# EasyEDA Pro project zFocus_remote_ferq.eprj

# Schematic Schematic1
Create Date: 2023-02-25; Page Name: P1; Project Name: zFocus_remote_ferq; Schematic Name: Schematic1; Update Date: 2023-02-25; Company: 嘉立创EDA; Page Size: A4; Version: V1.0
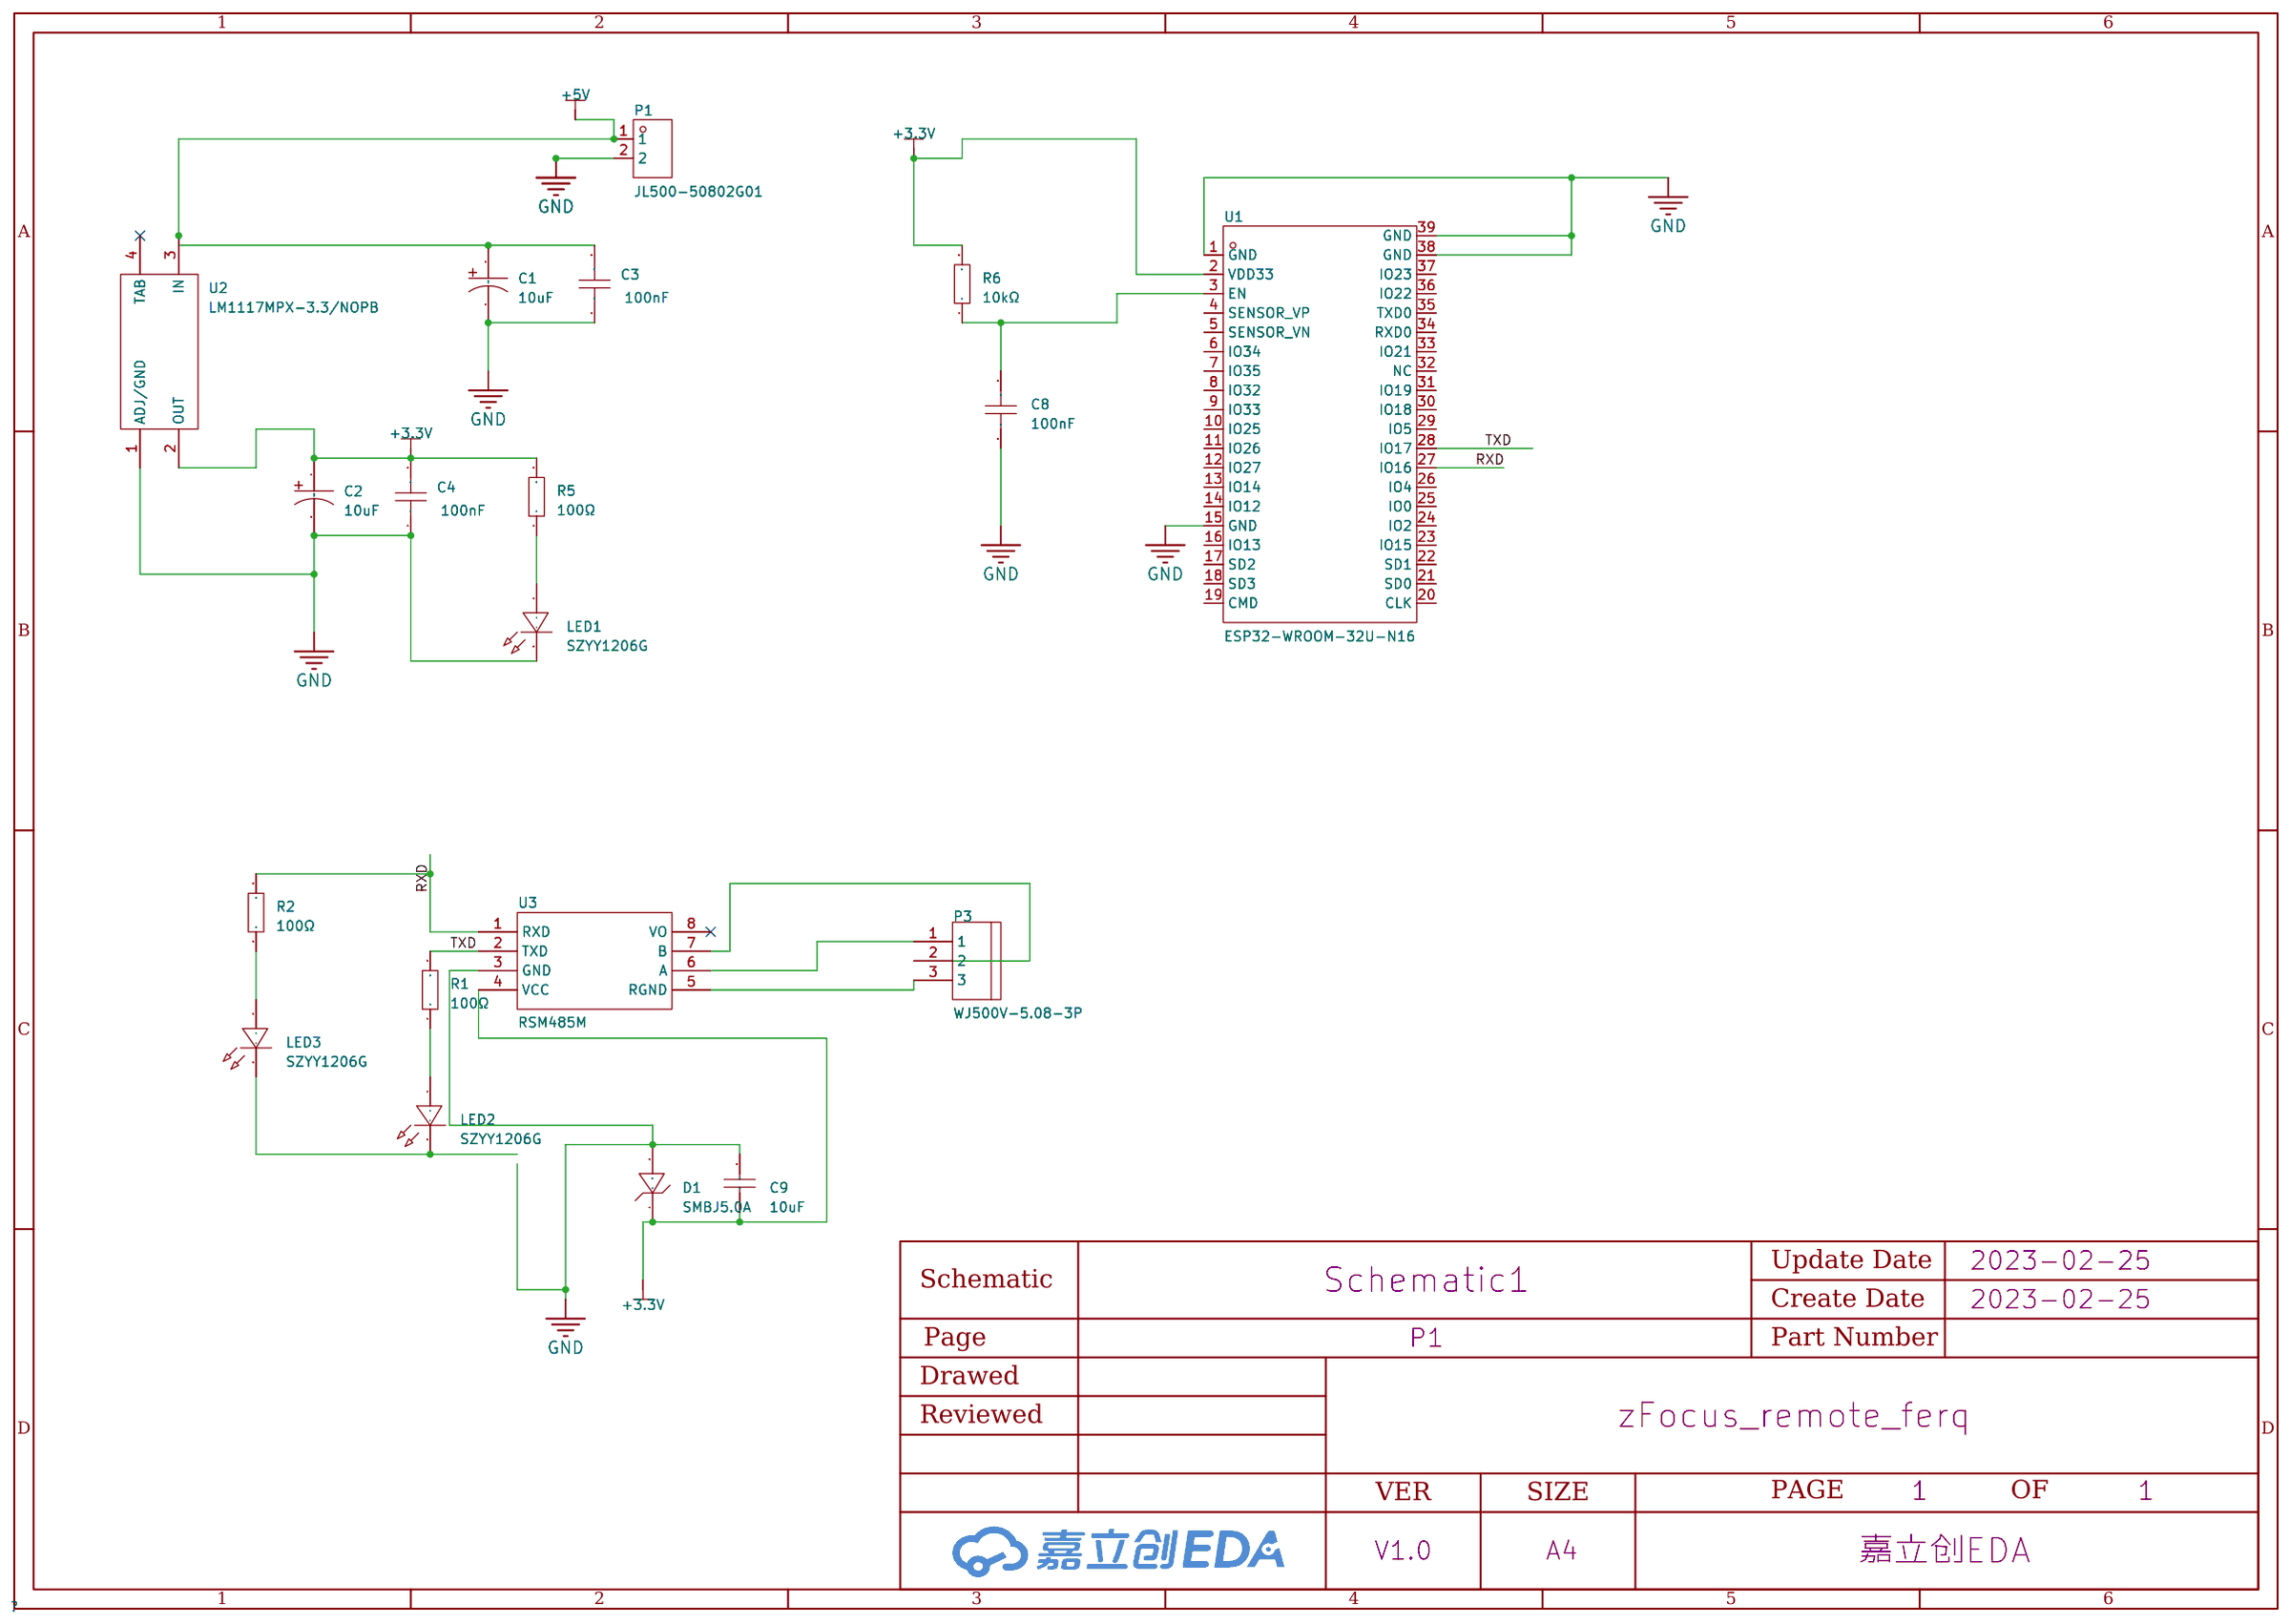
[diagram p0: schematic sheet]

## Parts
C1  10uF  [CAP-SMD_BD4.0-L4.3-W4.3-LS5.0-FD]
C2  10uF  [CAP-SMD_BD4.0-L4.3-W4.3-LS5.0-FD]
C3  100nF  [C1206]
C4  100nF  [C1206]
C8  100nF  [C1206]
C9  10uF  [C1206]
D1  SMBJ5.0A  [SMB_L4.6-W3.6-LS5.3-RD]
LED1  SZYY1206G  [LED1206-R-RD]
LED2  SZYY1206G  [LED1206-R-RD]
LED3  SZYY1206G  [LED1206-R-RD]
P1  JL500-50802G01  [CONN-TH_2P-P5.08_JL500-50002G01]
P3  WJ500V-5.08-3P  [CONN-TH_3P-P5.00_WJ500V-5.08-3P]
R1  100Ω  [R1206]
R2  100Ω  [R1206]
R5  100Ω  [R1206]
R6  10kΩ  [R1206]
U1  ESP32-WROOM-32U-N16  [WIFIM-SMD_39P-L19.2-W18.0-P1.27]
U2  LM1117MPX-3.3/NOPB  [SOT-223-3_L6.5-W3.4-P2.30-LS7.0-BR]
U3  RSM485M  [COMM-TH_RSM485M]

## Library data of the parts
C1 C2 = RVT1V100M0405: 容值:10uF;精度:±20%;额定电压:35V;电容体直径:4mm;电容体长度:5.4mm;纹波电流:-;等效串联电阻:-;工作寿命:2000hrs@105℃;工作温度:-55℃~+105℃;; LCSC Part Name: 10uF ±20% 35V; Supplier Part: C86602; Manufacturer: HONOR(荣誉); Supplier Footprint: SMD,D4xL5.4mm; JLCPCB Part Class: Extended Part; Datasheet: https://atta.szlcsc.com/upload/public/pdf/source/20210521/C113284_25C86AE95FB541053FE695F13EA8E7D0.pdf; Supplier: LCSC; Tolerance: ±20%; Rated Voltage: 35V; φD: 4mm; L: 5.4mm; Lifetime @ Temp: 2000hrs@105℃; Operating Temperature: -55℃~+105℃
C3 C4 = TCC1206X7R104M500DT: 温度系数:X7R;容值:100nF;精度:±20%;额定电压:50V;; LCSC Part Name: 100nF(104) ±20% 50V; Supplier Part: C377067; Manufacturer: CCTC(三环); Supplier Footprint: 1206; JLCPCB Part Class: Extended Part; Datasheet: https://atta.szlcsc.com/upload/public/pdf/source/20190327/C377067_340E4DDDA8A40C1E413FF83585EE122C.pdf; Supplier: LCSC; Temperature Coefficient: X7R; Tolerance: ±20%; Voltage Rated: 50V
C8 = CC1206KRX7R9BB104: 容值:100nF;精度:±10%;额定电压:50V;材质(温度系数):X7R;; LCSC Part Name: 100nF ±10% 50V; Supplier Part: C82601; Manufacturer: YAGEO(国巨); Supplier Footprint: 1206; JLCPCB Part Class: Extended Part; Datasheet: https://atta.szlcsc.com/upload/public/pdf/source/20161024/1477288461832.pdf; Supplier: LCSC; Tolerance: ±10%; Voltage Rated: 50V; Temperature Coefficient: X7R
C9 = CL31A106KAHNNNE: 容值:10uF;精度:±10%;额定电压:25V;材质(温度系数):X5R;; LCSC Part Name: 10uF ±10% 25V; Supplier Part: C9807; Manufacturer: SAMSUNG(三星); Supplier Footprint: 1206; JLCPCB Part Class: Extended Part; Datasheet: https://atta.szlcsc.com/upload/public/pdf/source/20160103/1457707744674.pdf; Supplier: LCSC; Tolerance: ±10%; Voltage Rated: 25V; Temperature Coefficient: X5R
D1 = SMBJ5.0A_C83333: 极性:单向;反向截止电压(Vrwm):5V;击穿电压:6.4V;峰值脉冲电流(Ipp)@10/1000s:-;最大钳位电压:9.2V;峰值脉冲功率(Ppp)@10/1000s:600W;; LCSC Part Name: 单向 Vrwm:5V 600W; Supplier Part: C83333; Manufacturer: Littelfuse(美国力特); Supplier Footprint: SMB(DO-214AA); JLCPCB Part Class: Extended Part; Datasheet: https://atta.szlcsc.com/upload/public/pdf/source/20180622/C83333_54A96CB13F34736FC2597463A926577F.pdf; Supplier: LCSC; Polarity: 单向; Reverse Stand-Off Voltage (Vrwm): 5V; Breakdown Voltage: 6.4V; Maximum Clamping Voltage: 9.2V; Peak Pulse Power Dissipation (Ppp)@10/1000μs: 600W
LED1-LED3 = SZYY1206G: 发光颜色:翠绿;; LCSC Part Name: 翠绿; Supplier Part: C434439; Manufacturer: yongyu(永裕光电); Supplier Footprint: 1206; JLCPCB Part Class: Extended Part; Datasheet: https://atta.szlcsc.com/upload/public/pdf/source/20200628/C434439_0A6287F1EA2604FB8C8003896F01CB92.pdf; Supplier: LCSC; Emitted Color: 翠绿
P1 = JL500-50802G01_C709041: 间距:5.08mm;排数:1;每排PIN数:2;额定电流:15A;额定电压:300V;线规 - AWG:26~14;线规 - mm?:0.2~2;触头材质:铜;触头镀层:锡;工作温度范围:-40℃~+105℃;焊接温度(最大值):250℃;颜色:绿色;; LCSC Part Name: 5.08mm 排数:1 每排P数:2; Supplier Part: C709041; Manufacturer: JILN(锦凌); Supplier Footprint: P=5.08mm; JLCPCB Part Class: Extended Part; Supplier: LCSC; Pitch: 5.08mm; Number of Rows: 1; Number of PINs Per Row: 2; Current Rating (Max): 15A; Voltage Rating (Max): 300V; Wire Gauge - AWG: 26~14; Wire Gauge - mm?: 0.2~2; Contact Material: 铜; Contact Plating: 锡; Operating Temperature Range: -40℃~+105℃; Welding Temperature (Max): 250℃; Color: 绿色
P3 = WJ500V-5.08-3P: 间距:5.08mm;排数:1;每排PIN数:3;安装方式:直针;额定电流:18A;额定电压:250V;线规 - AWG:14~30;线规 - mm2:2.5;工作温度范围:-40℃~+105℃;颜色:绿色;; LCSC Part Name: 5.08mm 排数:1 每排P数:3 直针 可拼接; Supplier Part: C72334; Manufacturer: KANGNEX(康奈克斯电气); Supplier Footprint: 插件,P=5.08mm; JLCPCB Part Class: Extended Part; Datasheet: https://atta.szlcsc.com/upload/public/pdf/source/20191225/C72334_8A5EF831D67650233B6B1E3F2BC06274.pdf; Supplier: LCSC; Pitch: 5.08mm; Number of Rows: 1; Number of PINs Per Row: 3; Mounting Style: 直针; Current Rating (Max): 18A; Voltage Rating (Max): 250V; Wire Gauge - AWG: 14~30; Wire Gauge - mm2: 2.5; Operating Temperature Range: -40℃~+105℃; Color: 绿色
R1 R2 R5 = 1206W4F1000T5E: 电阻类型:厚膜电阻;阻值:100Ω;精度:±1%;功率:250mW;温度系数:±100ppm/℃;最大工作电压:200V;工作温度范围:-55℃~+155℃;; LCSC Part Name: 100Ω ±1% 250mW; Supplier Part: C17901; Manufacturer: UNI-ROYAL(厚声); Supplier Footprint: 1206; JLCPCB Part Class: Basic Part; Datasheet: https://atta.szlcsc.com/upload/public/pdf/source/20200306/C422600_1E6D84923E4A46A82E41ADD87F860B5C.pdf; Supplier: LCSC; Type: 厚膜电阻; Tolerance: ±1%; Power(Watts): 250mW; Temperature Coefficient: ±100ppm/℃; Overload Voltage (Max): 200V; Operating Temperature Range: -55℃~+155℃
R6 = 1206W4F1002T5E: 电阻类型:厚膜电阻;阻值:10kΩ;精度:±1%;功率:250mW;温度系数:±100ppm/℃;最大工作电压:200V;工作温度范围:-55℃~+155℃;; LCSC Part Name: 10kΩ ±1% 250mW; Supplier Part: C17902; Manufacturer: UNI-ROYAL(厚声); Supplier Footprint: 1206; JLCPCB Part Class: Basic Part; Datasheet: https://atta.szlcsc.com/upload/public/pdf/source/20200306/C422600_1E6D84923E4A46A82E41ADD87F860B5C.pdf; Supplier: LCSC; Type: 厚膜电阻; Tolerance: ±1%; Power(Watts): 250mW; Temperature Coefficient: ±100ppm/℃; Overload Voltage (Max): 200V; Operating Temperature Range: -55℃~+155℃
U1 = ESP32-WROOM-32U-N16_C529580: Supplier Part: C529580; Manufacturer: ESPRESSIF(乐鑫); JLCPCB Part Class: Extended Part; Datasheet: https://atta.szlcsc.com/upload/public/pdf/source/20200521/C529577_90A62DBC94C4A28650A646C18DE51576.pdf; Supplier: LCSC
U2 = LM1117MPX-3.3/NOPB: 输出类型:固定;输出极性:正;输出通道数:1;最大输入电压:15V;输出电压:3.3V;压差:1.2V@(800mA);输出电流:800mA;电源纹波抑制比(PSRR):75dB@(120Hz);; LCSC Part Name: 正 Vin=15V Vout=3.3V 800mA 75dB@(120Hz); Supplier Part: C9662; Manufacturer: TI(德州仪器); Supplier Footprint: SOT-223; JLCPCB Part Class: Extended Part; Datasheet: https://atta.szlcsc.com/upload/public/pdf/source/20160806/1470478007762.pdf; Supplier: LCSC; Output Type: 固定; Output Polarity: 正; Number of Outputs: 1; Maximum Input Voltage: 15V; Output Voltage: 3.3V; Dropout Voltage: 1.2V@(800mA); Output Current: 800mA; Power Supply Rejection Ratio (PSRR): 75dB@(120Hz)
U3 = RSM485M: 数据速率:500Kbps;节点数:64;静态电流:27mA;电源电压:3.15V~5.25V;静电保护:否;隔离:2500V;自动流控:否;; LCSC Part Name: 500Kbps 64; Supplier Part: C133365; Manufacturer: ZLG(致远电子); Supplier Footprint: DIP-8; JLCPCB Part Class: Extended Part; Datasheet: https://atta.szlcsc.com/upload/public/pdf/source/20171014/C133365_15079755010921038240.pdf; Supplier: LCSC; Data Rate: 500Kbps; Node Number: 64; Quiescent Current: 27mA; Supply Voltage: 3.15V~5.25V; ESD Protect: 否; isolation: 2500V; Automatic flow control: 否; Operating Temperature: -40℃~+105℃

## Nets
+3.3V: C2.1 C4.2 C9.1 D1.1 R5.2 R6.2 U1.2(VDD33) U2.2(OUT) U3.4(VCC)
+5V: C1.1 C3.2 P1.1 U2.3(IN)
GND: C1.2 C2.2 C3.1 C4.1 C8.1 C9.2 D1.2 LED1.2(-) P1.2 U1.1(GND) U1.15(GND) U1.38(GND) U1.39(GND) U2.1(ADJ/GND) U3.3(GND)
RXD: R2.2 U1.27(IO16) U3.1(RXD)
TXD: R1.2 U1.28(IO17) U3.2(TXD)
$1N581: LED1.1(+) R5.1
$1N1533: C8.2 R6.1 U1.3(EN)
$1N3841: P3.3 U3.5(RGND)
$1N3861: P3.1 U3.6(A)
$1N3882: P3.2 U3.7(B)
$1N5862: LED2.1(+) R1.1
$1N5884: LED3.1(+) R2.1
$1N6475: LED2.2(-) LED3.2(-)

Not connected (* = marked no-connect by the designer): U1 4(SENSOR_VP) 5(SENSOR_VN) 6(IO34) 7(IO35) 8(IO32) 9(IO33) 10(IO25) 11(IO26) 12(IO27) 13(IO14) 14(IO12) 16(IO13) 17(SD2) 18(SD3) 19(CMD) 20(CLK) 21(SD0) 22(SD1) 23(IO15) 24(IO2) 25(IO0) 26(IO4) 29(IO5) 30(IO18) 31(IO19) 32(NC) 33(IO21) 34(RXD0) 35(TXD0) 36(IO22) 37(IO23); U2 4(TAB)*; U3 8(VO)*

# Board PCB1
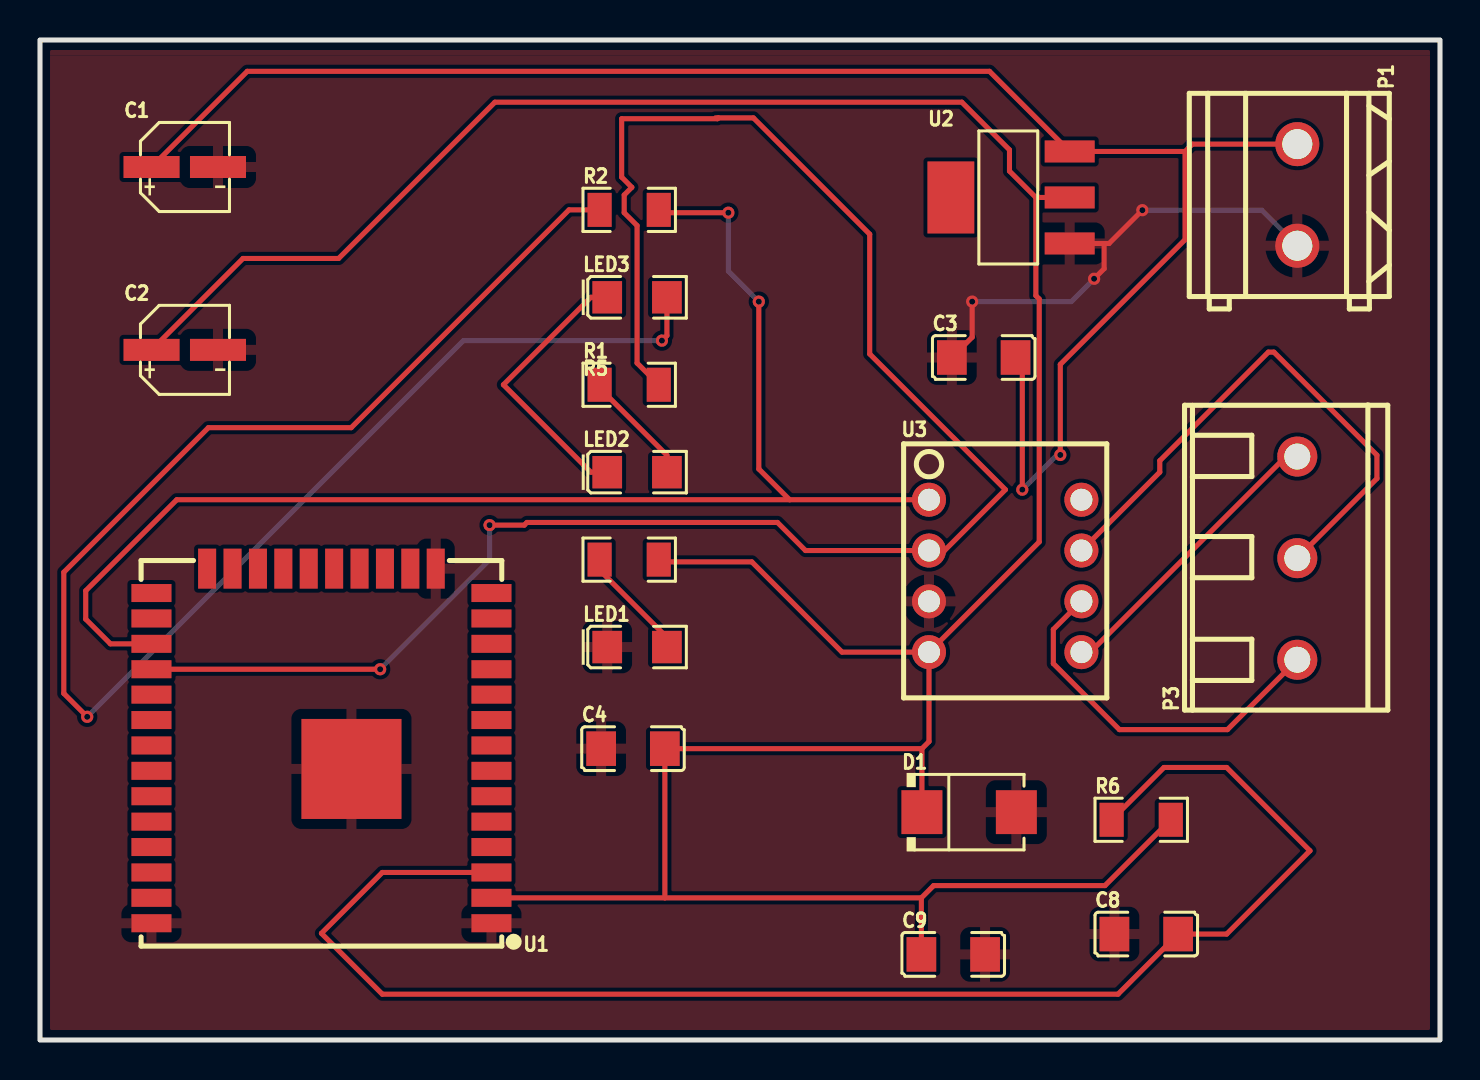
[diagram p1: board, top side]
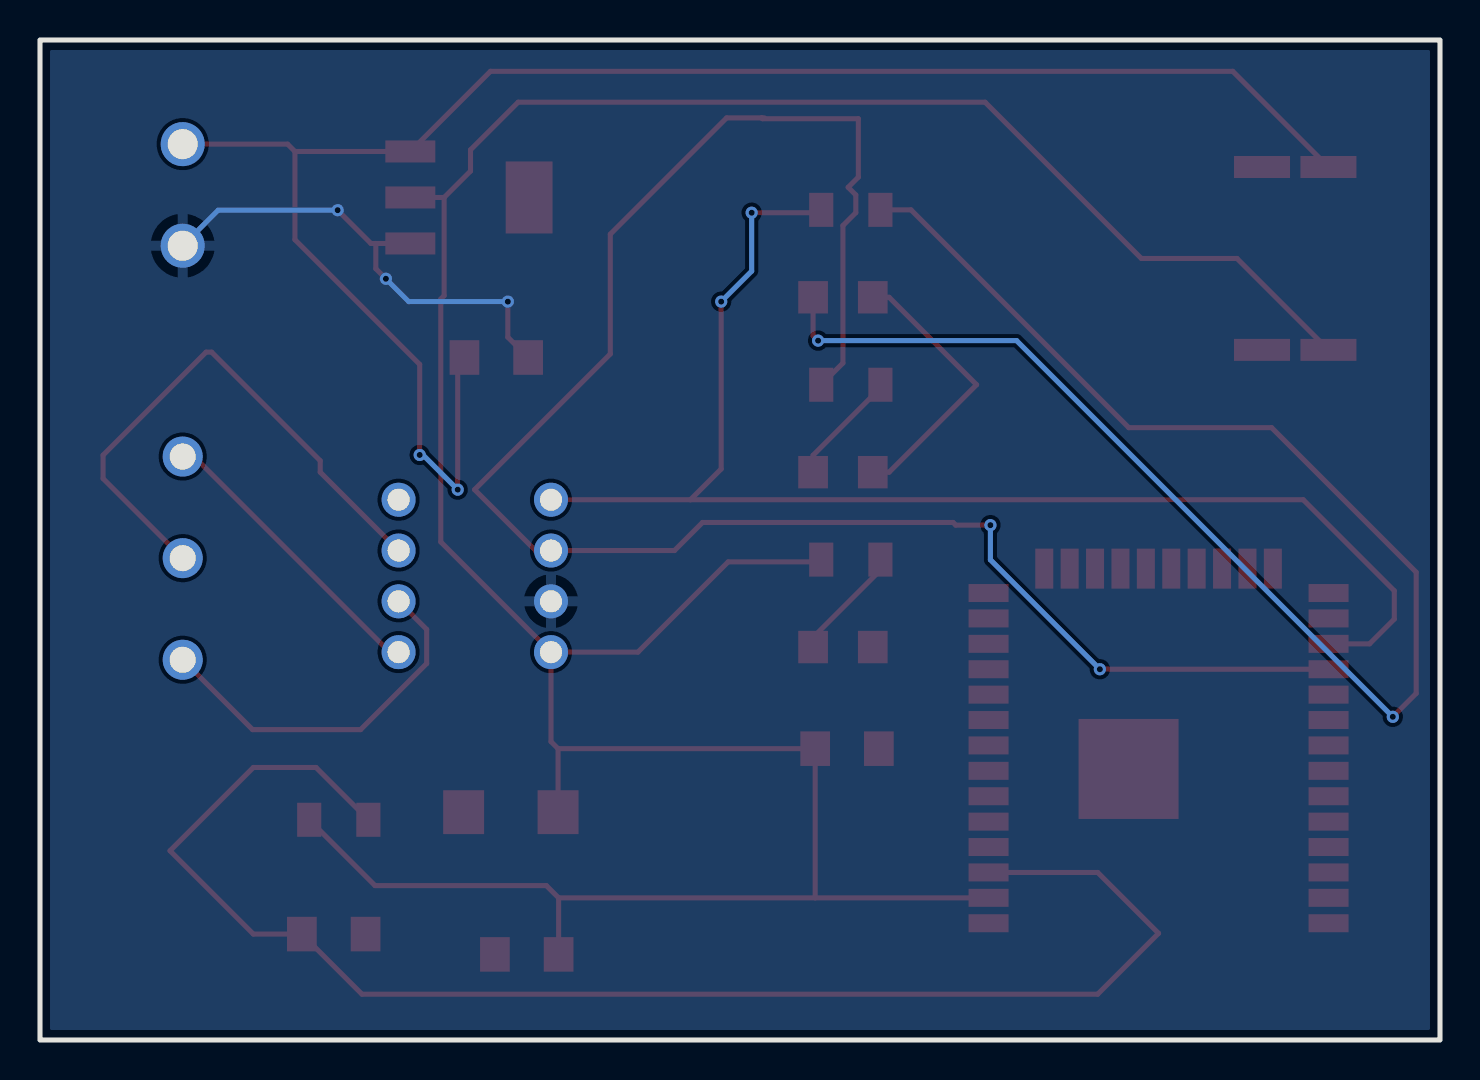
[diagram p2: board, bottom side, seen from below]

Outline 70 x 50 mm; copper layers: Top Layer, Bottom Layer. Coordinates in mm from the lower left corner of the outline.
Outline path: rectangle 0,50 70,0
Stack: Top Layer 0.035mm / Dielectric1 1.51mm FR4 er 4.5 / Bottom Layer 0.035mm

## Design rules (mm)
spacing safeClearance (default): track to track 0.152, other pairs 0.152 to 0.3
track width trackWidth (default): min 0.127, default 0.254, max 2.54
differential pair differentialPair (default): width min 0.127, default 0.254, max 2.54; gap min 0.152, default 0.152
via viaSize (default): diameter min 0.5, default 0.61, max 10; hole min 0.3, default 0.305, max 6

## Placement (name value [footprint] x y rotation side)
C1  10uF  [CAP-SMD_BD4.0-L4.3-W4.3-LS5.0-FD]  7.24 43.65 0 top
C2  10uF  [CAP-SMD_BD4.0-L4.3-W4.3-LS5.0-FD]  7.24 34.51 0 top
C3  100nF  [C1206]  47.19 34.13 0 top
C4  100nF  [C1206]  29.65 14.57 0 top
C8  100nF  [C1206]  55.31 5.3 0 top
C9  10uF  [C1206]  45.66 4.28 0 top
D1  SMBJ5.0A  [SMB_L4.6-W3.6-LS5.3-RD]  46.46 11.39 0 top
LED1  SZYY1206G  [LED1206-R-RD]  29.85 19.65 0 top
LED2  SZYY1206G  [LED1206-R-RD]  29.85 28.39 0 top
LED3  SZYY1206G  [LED1206-R-RD]  29.85 37.14 0 top
P1  JL500-50802G01  [CONN-TH_2P-P5.08_JL500-50002G01]  62.86 42.25 270 top
P3  WJ500V-5.08-3P  [CONN-TH_3P-P5.00_WJ500V-5.08-3P]  62.86 24.09 90 top
R1  100Ω  [R1206]  29.46 32.76 0 top
R2  100Ω  [R1206]  29.46 41.51 0 top
R5  100Ω  [R1206]  29.46 24.02 0 top
R6  10kΩ  [R1206]  55.06 11.01 0 top
U1  ESP32-WROOM-32U-N16  [WIFIM-SMD_39P-L19.2-W18.0-P1.27]  14.07 14.7 180 top
U2  LM1117MPX-3.3/NOPB  [SOT-223-3_L6.5-W3.4-P2.30-LS7.0-BR]  48.51 42.13 0 top
U3  RSM485M  [COMM-TH_RSM485M]  48.26 23.2 0 top

## Footprints (pads in the part's own frame, mm; a bottom-side part is the same pattern mirrored in y, then rotated)
C1206
  rect 1.485x1.728 smd: 1(-1.593,0) 2(1.593,0)
CAP-SMD_BD4.0-L4.3-W4.3-LS5.0-FD
  rect 2.8x1.1 smd: 1(-1.661,0) 2(1.661,0)
COMM-TH_RSM485M
  round 1.7 hole 1.1: 1(-3.81,3.81) 2(-3.81,1.27) 3(-3.81,-1.27) 4(-3.81,-3.81) 5(3.81,-3.81) 6(3.81,-1.27) 7(3.81,1.27) 8(3.81,3.81)
CONN-TH_2P-P5.08_JL500-50002G01
  round 2.2 hole 1.5: 1(-2.54,0) 2(2.54,0)
CONN-TH_3P-P5.00_WJ500V-5.08-3P
  round 2 hole 1.3: 1(-5.08,0) 2(0,0) 3(5.08,0)
LED1206-R-RD
  rect 1.485x1.62 smd: 1(1.492,0) 2(-1.492,0)
R1206
  rect 1.208x1.701 smd: 1(-1.479,0) 2(1.479,0)
SMB_L4.6-W3.6-LS5.3-RD
  rect 2.047x2.192 smd: 1(-2.361,0) 2(2.361,0)
SOT-223-3_L6.5-W3.4-P2.30-LS7.0-BR
  rect 2.5x1.1 smd: 1(2.97,-2.3) 2(2.97,0) 3(2.97,2.3)
  rect 2.34x3.6 smd: 4(-2.97,0)
WIFIM-SMD_39P-L19.2-W18.0-P1.27
  rect 2x0.9 smd: 1(-8.5,8.865) 2(-8.5,7.595) 3(-8.5,6.325) 4(-8.5,5.055) 5(-8.5,3.785) 6(-8.5,2.515) 7(-8.5,1.245) 8(-8.5,-0.025) 9(-8.5,-1.295) 10(-8.5,-2.565) 11(-8.5,-3.835) 12(-8.5,-5.105) 13(-8.5,-6.375) 14(-8.5,-7.645) 25(8.5,-7.645) 26(8.5,-6.375) 27(8.5,-5.105) 28(8.5,-3.835) 29(8.5,-2.565) 30(8.5,-1.295) 31(8.5,-0.025) 32(8.5,1.245) 33(8.5,2.515) 34(8.5,3.785) 35(8.5,5.055) 36(8.5,6.325) 37(8.5,7.595) 38(8.5,8.865)
  rect 0.9x2 smd: 15(-5.715,-8.865) 16(-4.445,-8.865) 17(-3.175,-8.865) 18(-1.905,-8.865) 19(-0.635,-8.865) 20(0.635,-8.865) 21(1.905,-8.865) 22(3.175,-8.865) 23(4.445,-8.865) 24(5.715,-8.865)
  rect 5x5 smd: 39(-1.5,1.15)

## Nets
As in the schematic.

Pads without a net: U1 4 5 6 7 8 9 10 11 12 13 14 16 17 18 19 20 21 22 23 24 25 26 29 30 31 32 33 34 35 36 37; U2 4; U3 8

## Via types
v1: diameter 0.61, hole 0.305, Top Layer to Bottom Layer, 11 vias

## Routing (per net, layer and track width the routed paths; a pad name or vN(x,y) marks a point on that pad's centre or on a via; arc(x,y) is an arc through that point)
+3.3V: length 161
  Top Layer w0.254: U3.4 44.45,14.92 44.1,14.57 ; U3.4 40.1,19.39 35.59,23.91 31.05,23.91 R5.2 ; U3.4 49.96,24.9 49.96,37.05 49.79,37.22 49.79,42.13 ; 31.24,7.11 44.07,7.11 ; 31.24,7.11 C4.2 44.1,14.57 ; 31.24,7.11 U1.2 ; 44.07,7.11 44.68,7.72 53.25,7.72 R6.2 ; 44.07,7.11 C9.1 ; 49.79,42.13 U2.2 ; 49.79,42.13 48.47,43.45 48.47,44.51 46.09,46.89 22.74,46.89 14.93,39.08 10.15,39.08 C2.1 ; 44.1,14.57 D1.1
+5V: length 88.2
  Top Layer w0.254: 57.25,44.43 57.62,44.79 P1.1 ; 57.25,44.43 57.25,40.02 51.02,33.78 v1(51.02,29.25) ; 57.25,44.43 U2.3 47.48,48.43 10.36,48.43 C1.1 ; v1(49.11,27.52) 49.11,33.79 C3.2
  Bottom Layer w0.254: v1(49.11,27.52) 50.85,29.25 v1(51.02,29.25)
GND: length 24.6
  Top Layer w0.254: v1(46.61,36.92) 46.61,35.14 C3.1 ; v1(55.12,41.49) 53.45,39.83 53.21,39.83 ; U2.1 53.21,39.83 ; 53.21,39.83 53.21,38.57 v1(52.7,38.06)
  Bottom Layer w0.254: P1.2 61.09,41.49 v1(55.12,41.49) ; v1(52.7,38.06) 51.56,36.92 v1(46.61,36.92)
RXD: length 68.4
  Top Layer w0.254: U1.27 3.52,19.81 2.29,21.04 2.29,22.46 6.84,27.01 37.48,27.01 ; 37.48,27.01 35.94,28.55 v1(35.94,36.92) ; 37.48,27.01 U3.1 ; v1(34.42,41.36) 31.08,41.36 R2.2
  Bottom Layer w0.254: v1(34.42,41.36) 34.42,38.44 v1(35.94,36.92)
TXD: length 93.5
  Top Layer w0.254: R1.2 29.85,33.85 29.85,40.72 29.21,41.36 29.21,42.25 29.59,42.63 29.08,43.14 29.08,46.06 33.87,46.06 33.91,46.11 ; v1(17.01,18.54) U1.28 ; 33.91,46.11 33.78,46.11 ; 33.91,46.11 35.67,46.11 41.48,40.29 41.48,34.3 48.27,27.52 45.23,24.47 U3.2 38.28,24.47 36.87,25.88 24.35,25.88 24.21,25.74 v1(22.48,25.74)
  Bottom Layer w0.254: v1(22.48,25.74) 22.48,24.01 v1(17.01,18.54)
$1N581: length 5.8
  Top Layer w0.254: R5.1 27.98,23.5 31.35,20.13 LED1.1
$1N1533: length 76.1
  Top Layer w0.254: 53.58,11.01 56.2,13.63 59.33,13.63 63.5,9.46 59.33,5.3 C8.2 53.9,2.29 17.12,2.29 14.07,5.33 17.12,8.38 U1.3
$1N3841: length 14.8
  Top Layer w0.254: U3.5 52.52,19.39 62.29,29.17 P3.3
$1N3861: length 18.7
  Top Layer w0.254: P3.1 59.37,15.52 53.97,15.52 50.67,18.82 50.67,20.53 U3.6
$1N3882: length 28.2
  Top Layer w0.254: P3.2 66.85,28.07 66.85,29.24 61.7,34.39 61.42,34.39 55.99,28.96 55.99,28.39 U3.7
$1N5862: length 5.8
  Top Layer w0.254: LED2.1 31.35,29.24 27.98,32.6 R1.1
$1N5884: length 80.8
  Top Layer w0.254: R2.1 26.45,41.51 15.56,30.62 8.42,30.62 1.19,23.39 1.19,17.33 v1(2.36,16.16) ; LED3.1 31.35,35.22 v1(31.1,34.97)
  Bottom Layer w0.254: v1(2.36,16.16) 21.17,34.97 v1(31.1,34.97)
$1N6475: length 14
  Top Layer w0.254: LED3.2 27.54,37.14 23.17,32.76 27.54,28.39 LED2.2

## Copper pours and planes (outline as drawn; the poured copper is in the pictures)
GND on Top Layer: -2.54,50.89 71.12,50.89 71.12,-1.69 -2.54,-1.69
GND on Top Layer: 0,50 69.98,50 69.98,-0.29 0,-0.29
GND on Top Layer: 0,49.22 69.98,49.22 69.98,-0.29 0,-0.29
GND on Bottom Layer: -2.54,52.54 73.53,52.54 73.53,-2.83 -2.54,-2.83

Small or netless copper shapes (teardrops, artwork), in the pictures only: 1 on Top Layer
